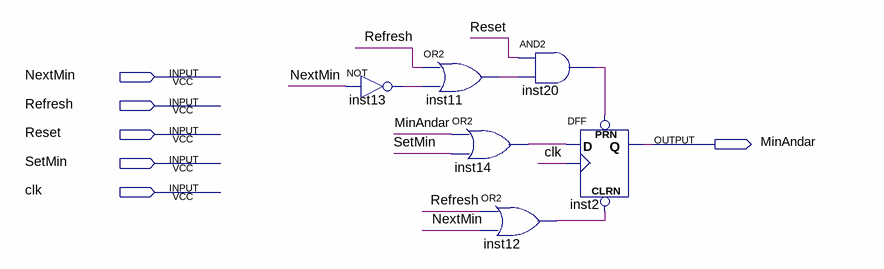
[diagram p0: schematic sheet]
// Quartus schematic MinAndar.bdf as structural Verilog: 6 symbols, 6 pins
module MinAndar (
  input  NextMin,
  input  Refresh,
  input  Reset,
  input  SetMin,
  input  clk,
  output MinAndar
);

  wire inst11_out, inst12_out, inst13_out, inst14_out, inst20_out;

  not inst13 (inst13_out, NextMin);
  or inst11 (inst11_out, Refresh, inst13_out);
  or inst14 (inst14_out, MinAndar, SetMin);
  and inst20 (inst20_out, Reset, inst11_out);
  or inst12 (inst12_out, Refresh, NextMin);
  DFF inst2 (.CLRN(inst12_out), .CLK(clk), .D(inst14_out), .PRN(inst20_out), .Q(MinAndar));
endmodule
